# EAGLE design konzole (EAGLE 9.6.2)
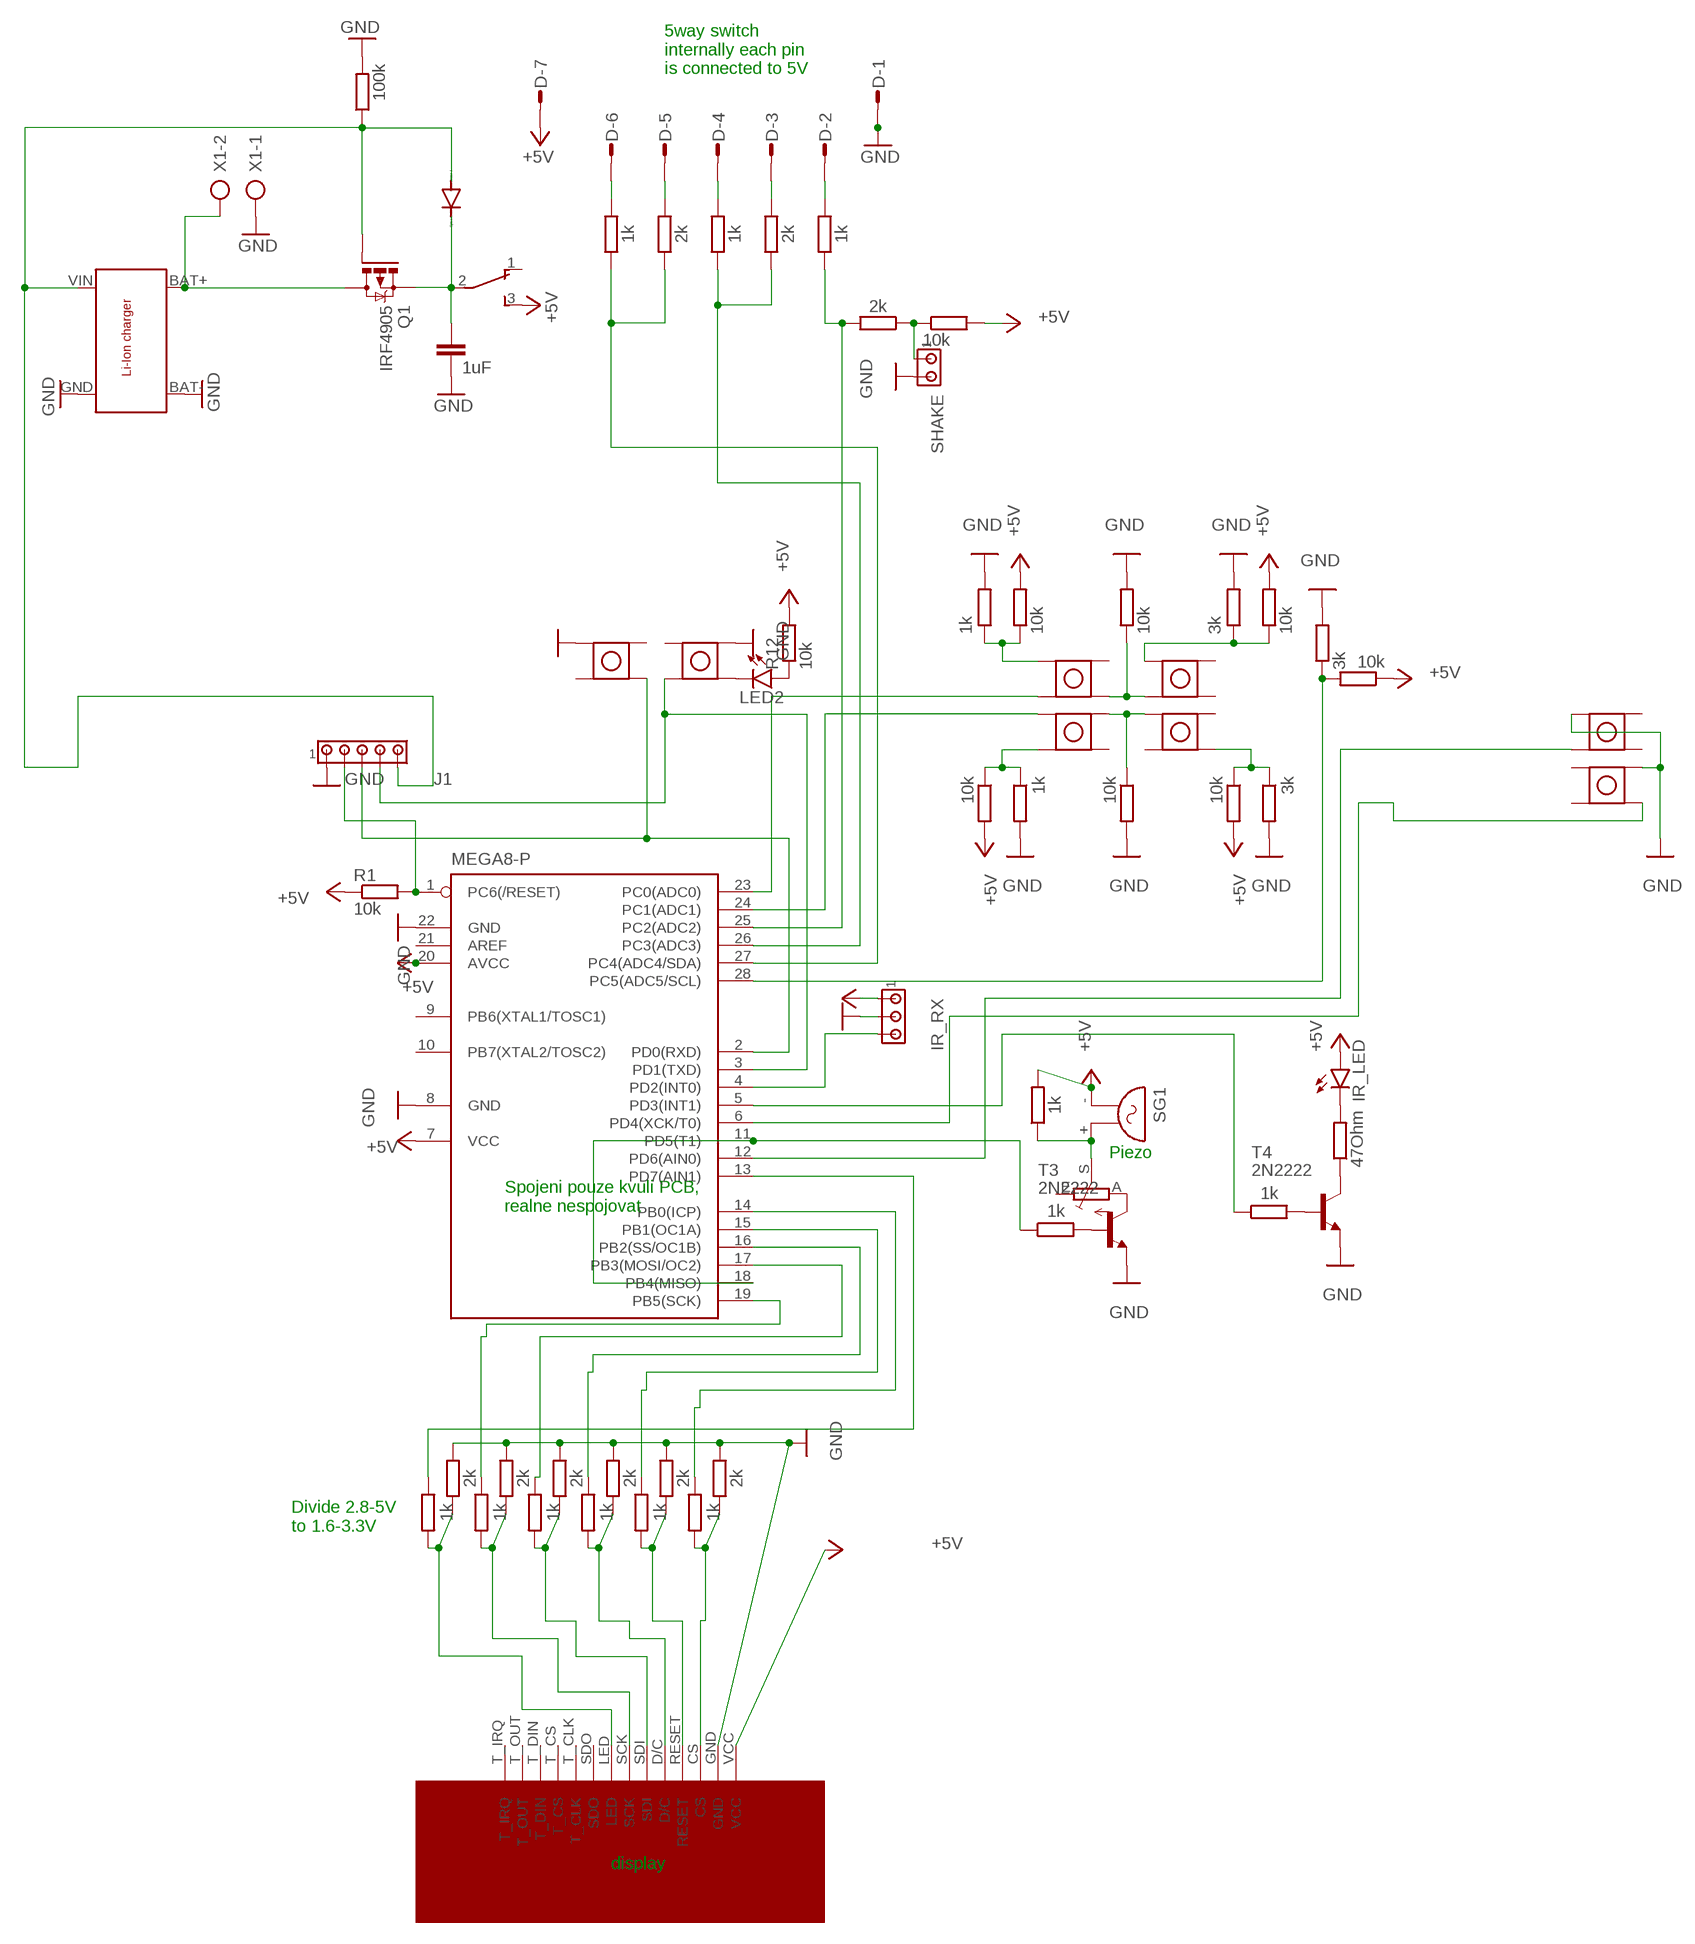
[diagram p0: schematic, sheet 1]

## Parts
C1  1uF  C-EU050-025X075  [C050-025X075]
D  L07P  [L07P]
D1  1N4004  [DO41-10]
IC1  MEGA8-P  [DIL28-3]
IR_LED  LED5MM  [LED5MM]
IR_RX  MTA03-100  [10X03MTA]
J1  MTA05-100  [10X05MTA]
LED2  LED3MM  [LED3MM]
Q1  IRF4905  [TO220BH]
R1  10k  R-EU_0207/10  [0207/10]
R2  1k  R-EU_0207/10  [0207/10]
R3  2k  R-EU_0207/10  [0207/10]
R4  1k  R-EU_0207/10  [0207/10]
R5  2k  R-EU_0207/10  [0207/10]
R6  1k  R-EU_0207/10  [0207/10]
R7  2k  R-EU_0207/10  [0207/10]
R8  1k  R-EU_0207/10  [0207/10]
R9  2k  R-EU_0207/10  [0207/10]
R10  1k  R-EU_0207/10  [0207/10]
R11  2k  R-EU_0207/10  [0207/10]
R12  10k  R-EU_0207/10  [0207/10]
R13  3k  R-EU_0207/10  [0207/10]
R14  10k  R-EU_0207/10  [0207/10]
R15  1k  R-EU_0207/10  [0207/10]
R16  10k  R-EU_0207/10  [0207/10]
R17  3k  R-EU_0207/10  [0207/10]
R18  10k  R-EU_0207/10  [0207/10]
R19  1k  R-EU_0207/10  [0207/10]
R20  10k  R-EU_0207/10  [0207/10]
R21  3k  R-EU_0207/10  [0207/10]
R22  10k  R-EU_0207/10  [0207/10]
R23  10k  R-EU_0207/10  [0207/10]
R24  1k  R-EU_0207/10  [0207/10]
R25  2k  R-EU_0207/10  [0207/10]
R26  1k  R-EU_0207/10  [0207/10]
R27  1k  R-EU_0207/10  [0207/10]
R28  TRIM_EU-CIP20C-6MM  [CIP20C-6MM]
R29  10k  R-EU_0207/10  [0207/10]
R33  1k  R-EU_0207/10  [0207/10]
R34  47Ohm  R-EU_0207/10  [0207/10]
R35  1k  R-EU_0207/10  [0207/10]
R36  2k  R-EU_0207/10  [0207/10]
R38  1k  R-EU_0207/10  [0207/10]
R39  2k  R-EU_0207/10  [0207/10]
R40  1k  R-EU_0207/10  [0207/10]
R41  2k  R-EU_0207/10  [0207/10]
R42  100k  R-EU_0207/10  [0207/10]
R49  10k  R-EU_0207/10  [0207/10]
S1  TL36PO  [TL3XPO]
SG1  F/QMX  [F/QMX]
SHAKE  MTA02-100  [10X02MTA]
T3  2N2222  [TO92-EBC-OVAL]
T4  2N2222  [TO92-EBC-OVAL]
U$1  TACT  [TACT]
U$2  DISPLAY  [DISPLAY]
U$3  TACT  [TACT]
U$4  TACT  [TACT]
U$5  TACT  [TACT]
U$6  TACT  [TACT]
U$7  TACT  [TACT]
U$8  TACT  [TACT]
U$9  TACT  [TACT]
U$10  LI_ION_CHARGER  [LI_ION_CHARGER]
X1  AK500/2  [AK500/2]

## Nets
+5V: D.7 IC1.7(VCC) IC1.20(AVCC) IR_LED.A IR_RX.1 R1.1 R12.2 R14.2 R16.2 R18.2 R20.2 R27.2 R29.1 R49.2 S1.3(S) SG1.- U$2.VCC
GND: C1.2 D.1 IC1.8(GND) IC1.22(GND) IR_RX.2 J1.1 R3.2 R5.2 R7.2 R9.2 R11.2 R13.2 R15.2 R17.2 R19.2 R21.2 R22.2 R23.2 R25.2 R42.2 SHAKE.2 T3.E T4.E U$2.GND U$6.P$4 U$7.P$1 U$8.P$1 U$9.P$4 U$10.BAT- U$10.GND X1.1
N$1: IC1.1(PC6(/RESET)) J1.2 R1.2
N$2: R2.2 R3.1 U$2.CS
N$3: R4.2 R5.1 U$2.RESET
N$4: R6.2 R7.1 U$2.D/C
N$5: R8.2 R9.1 U$2.SDI
N$6: R10.2 R11.1 U$2.SCK
N$7: IC1.17(PB3(MOSI/OC2)) R8.1
N$8: IC1.13(PD7(AIN1)) R24.1
N$9: IC1.16(PB2(SS/OC1B)) R6.1
N$10: IC1.15(PB1(OC1A)) R4.1
N$11: R14.1 R15.1 U$1.P$1
N$12: R27.1 R28.S SG1.+
N$13: IC1.19(PB5(SCK)) R10.1
N$14: R16.1 R17.1 U$5.P$1
N$15: R18.1 R19.1 U$3.P$2
N$16: R20.1 R21.1 U$4.P$3
N$17: R33.2 T4.B
N$18: LED2.K(C) U$9.P$3
N$19: IC1.2(PD0(RXD)) J1.3 U$8.P$3
N$20: IC1.3(PD1(TXD)) J1.4 U$9.P$2
N$21: R23.1 U$3.P$4 U$4.P$1
N$22: R22.1 U$1.P$3 U$5.P$2
N$23: IC1.23(PC0(ADC0)) U$1.P$2
N$24: R24.2 R25.1 U$2.LED
N$25: IC1.24(PC1(ADC1)) U$3.P$1
N$26: R34.1 T4.C
N$27: IC1.11(PD5(T1)) IC1.18(PB4(MISO)) R26.1
N$28: R26.2 T3.B
N$29: R28.A T3.C
N$30: IC1.14(PB0(ICP)) R2.1
N$32: IC1.12(PD6(AIN0)) U$7.P$2
N$33: IC1.28(PC5(ADC5/SCL)) R13.1 R29.2
N$34: IC1.6(PD4(XCK/T0)) U$6.P$3
N$35: LED2.A R12.1
N$36: IC1.4(PD2(INT0)) IR_RX.3
N$39: IR_LED.K(C) R34.2
N$40: IC1.5(PD3(INT1)) R33.1
N$41: D.6 R38.2
N$42: D.5 R36.2
N$43: D.4 R35.2
N$44: Q1.D U$10.BAT+ X1.2
N$45: D.3 R39.2
N$46: D.2 R40.2
N$48: IC1.26(PC3(ADC3)) R35.1 R39.1
N$49: R41.1 R49.1 SHAKE.1
N$50: D1.A J1.5 Q1.G R42.1 U$10.VIN
N$51: C1.1 D1.C Q1.S S1.2(P)
N$52: IC1.25(PC2(ADC2)) R40.1 R41.2
N$54: IC1.27(PC4(ADC4/SDA)) R36.1 R38.1
Unconnected: IC1.9(PB6(XTAL1/TOSC1)) IC1.10(PB7(XTAL2/TOSC2)) IC1.21(AREF) R28.E S1.1(O) U$1.P$4 U$2.SDO U$2.T_CLK U$2.T_CS U$2.T_DIN U$2.T_IRQ U$2.T_OUT U$3.P$3 U$4.P$2 U$4.P$4 U$5.P$3 U$5.P$4 U$6.P$1 U$6.P$2 U$7.P$3 U$7.P$4 U$8.P$2 U$8.P$4 U$9.P$1

## Notes on the sheet
- 5way switch
  internally each pin
  is connected to 5V
- Piezo
- Spojeni pouze kvuli PCB, 
  realne nespojovat
- Divide 2.8-5V
  to 1.6-3.3V
- display

## Library data of the parts
C1 = rcl:C-EU: CAPACITOR, European symbol; SPICEPREFIX: C
D = con-amp-mt:L07P: AMP MT CONNECTOR; OC_FARNELL: unknown; OC_NEWARK: unknown
D1 = diode:1N4004: DIODE general purpose rectifier, 1 A
IC1 = atmel:MEGA8-P: MICROCONTROLLER 8 Kbytes FLASH, 1 kbytes SRAM, 512 bytes EEPROM, USART, 4-channel 10 bit ADC, 2-channel 8 bit ADC Pin compatible with Atmega48, ATMega88, ATMega168 Source: avr.lbr; OC_FARNELL: unknown; OC_NEWARK: unknown
IR_LED LED2 = led:LED: LED OSRAM: - CHIPLED LG R971, LG N971, LY N971, LG Q971, LY Q971, LO R971, LY R971 LH N974, LH R974 LS Q976, LO Q976, LY Q976 LO Q996 - Hyper CHIPLED LW Q18S LB Q993, LB Q99A, LB R99A - SideLED LS A670, LO A670, LY A670, LG A670, LP A670 LB A673, LV A673, LT A673, LW A673 LH A674 LY A675 LS A676, LA A676, LO A676, LY A676, LW A676 LS A679, LY A679, LG A679 - Hyper Micro SIDELED® LS Y876, LA Y876, LO Y876, LY Y876 LT Y87S - SmartLED LW L88C, LW L88S LB L89C, LB L89S, LG L890 LS L89K, LO L89K, LY L89K LS L896, LA L896, LO L896, LY L896 - TOPLED LS T670, LO T670, LY T670, LG T670, LP T670 LSG T670, LSP T670, LSY T670, LOP T670, LYG T670 LG T671, LOG T671, LSG T671 LB T673, LV T673, LT T673, LW T673 LH T674 LS T676, LA T676, LO T676, LY T676, LB T676, LH T676, LSB T676, LW T676 LB T67C, LV T67C, LT T67C, LS T67K, LO T67K, LY T67K, LW E67C LS E67B, LA E67B, LO E67B, LY E67B, LB E67C, LV E67C, LT E67C LW T67C LS T679, LY T679, LG T679 LS T770, LO T770, LY T770, LG T770, LP T770 LB T773, LV T773, LT T773, LW T773 LH T774 LS E675, LA E675, LY E675, LS T675 LS T776, LA T776, LO T776, LY T776, LB T776 LHGB T686 LT T68C, LB T68C - Hyper Mini TOPLED® LB M676 - Mini TOPLED Santana® LG M470 LS M47K, LO M47K, LY M47K Source: http://www.osram.convergy.de LUXEON: - LUMILED® LXK2-PW12-R00, LXK2-PW12-S00, LXK2-PW14-U00, LXK2-PW14-V00 LXK2-PM12-R00, LXK2-PM12-S00, LXK2-PM14-U00 LXK2-PE12-Q00, LXK2-PE12-R00, LXK2-PE12-S00, LXK2-PE14-T00, LXK2-PE14-U00 LXK2-PB12-K00, LXK2-PB12-L00, LXK2-PB12-M00, LXK2-PB14-N00, LXK2-PB14-P00, LXK2-PB14-Q00 LXK2-PR12-L00, LXK2-PR12-M00, LXK2-PR14-Q00, LXK2-PR14-R00 LXK2-PD12-Q00, LXK2-PD12-R00, LXK2-PD12-S00 LXK2-PH12-R00, LXK2-PH12-S00 LXK2-PL12-P00, LXK2-PL12-Q00, LXK2-PL12-R00 Source: www.luxeon.com KINGBRIGHT: KA-3528ASYC Source: www.kingbright.com
IR_RX = con-amp:MTA03-100: AMP connector
J1 = con-amp:MTA05-100: AMP connector
Q1 = transistor-power:IRF4905: P-Channel HEXFET® Power MOSFET RDS(on)= 0.02 Ohm, ID = -74A Source: http://www.irf.com/product-info/datasheets/data/irf4905pbf.pdf
R1-R27 R29 R33-R36 R38-R42 R49 = rcl:R-EU_: RESISTOR, European symbol; SPICEPREFIX: R
R28 = pot:TRIM_EU-: POTENTIOMETER
S1 = switch:TL36PO: TINY SWITCH ON - ON Source: http://www2.produktinfo.conrad.com/datenblaetter/700000-724999/705152-da-01-de-Subminiaturschalter_TL_36YO.pdf
SG1 = buzzer:F/QMX: BUZZER Source: Buerklin; OC_FARNELL: unknown; OC_NEWARK: unknown
SHAKE = con-amp:MTA02-100: AMP connector
T3 T4 = adafruit:2N2222: NPN TRANSISTOR Big oval pads
U$1 U$3-U$9 = PSicho:TACT
U$2 = PSicho:DISPLAY
U$10 = PSicho:LI_ION_CHARGER
X1 = con-ptr500:AK500/2: CONNECTOR; OC_FARNELL: unknown; OC_NEWARK: unknown

## Board
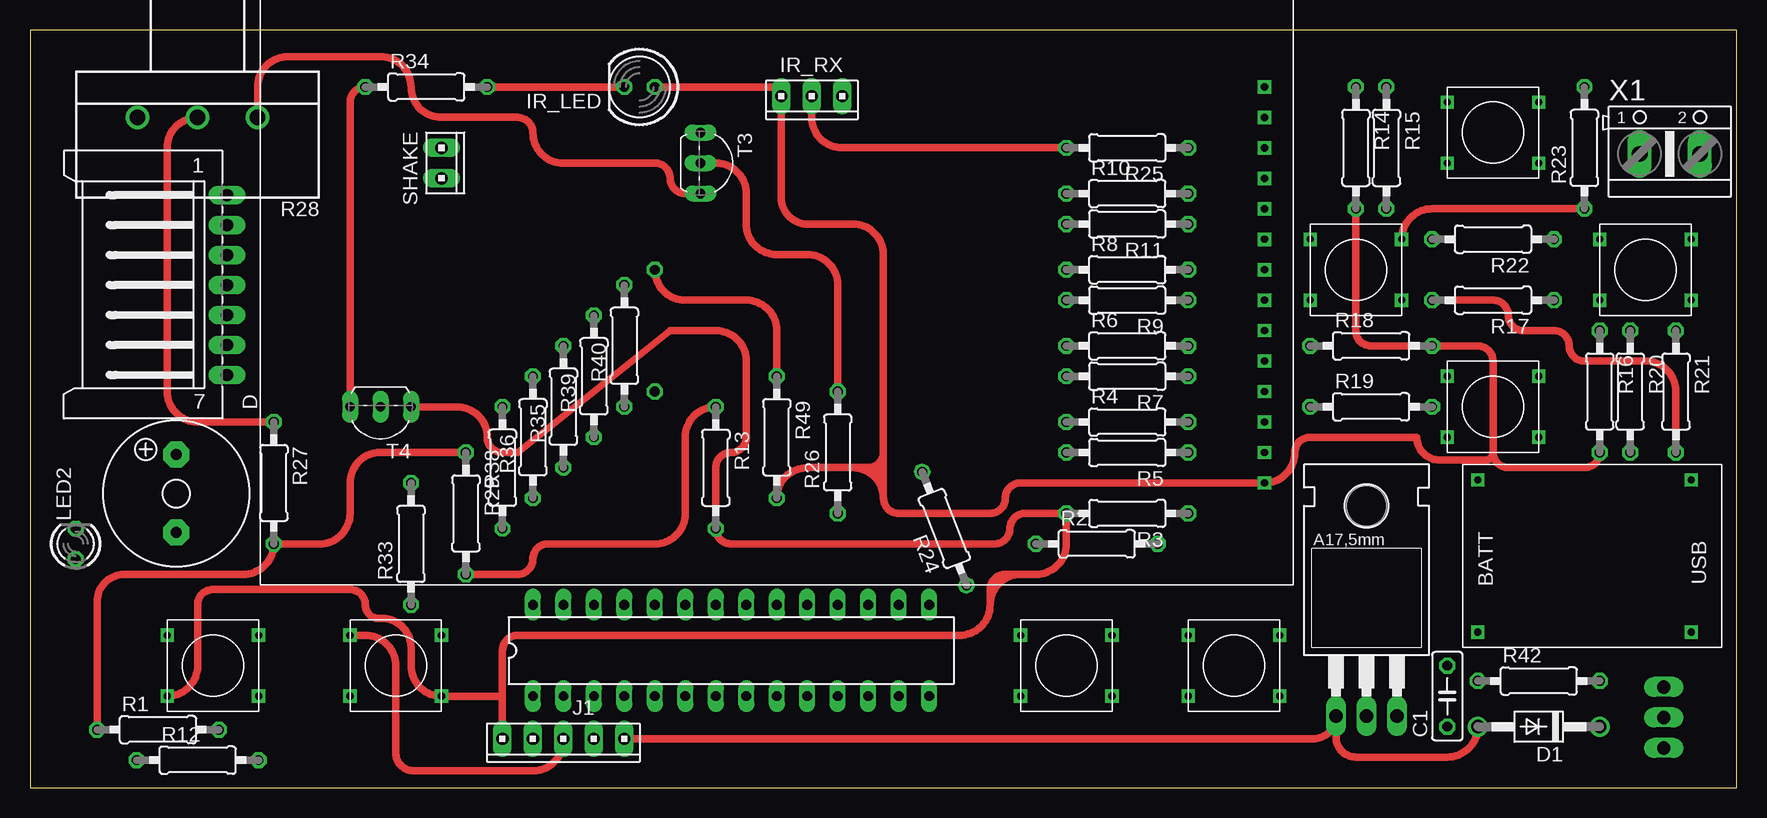
[diagram p1: board, top side]
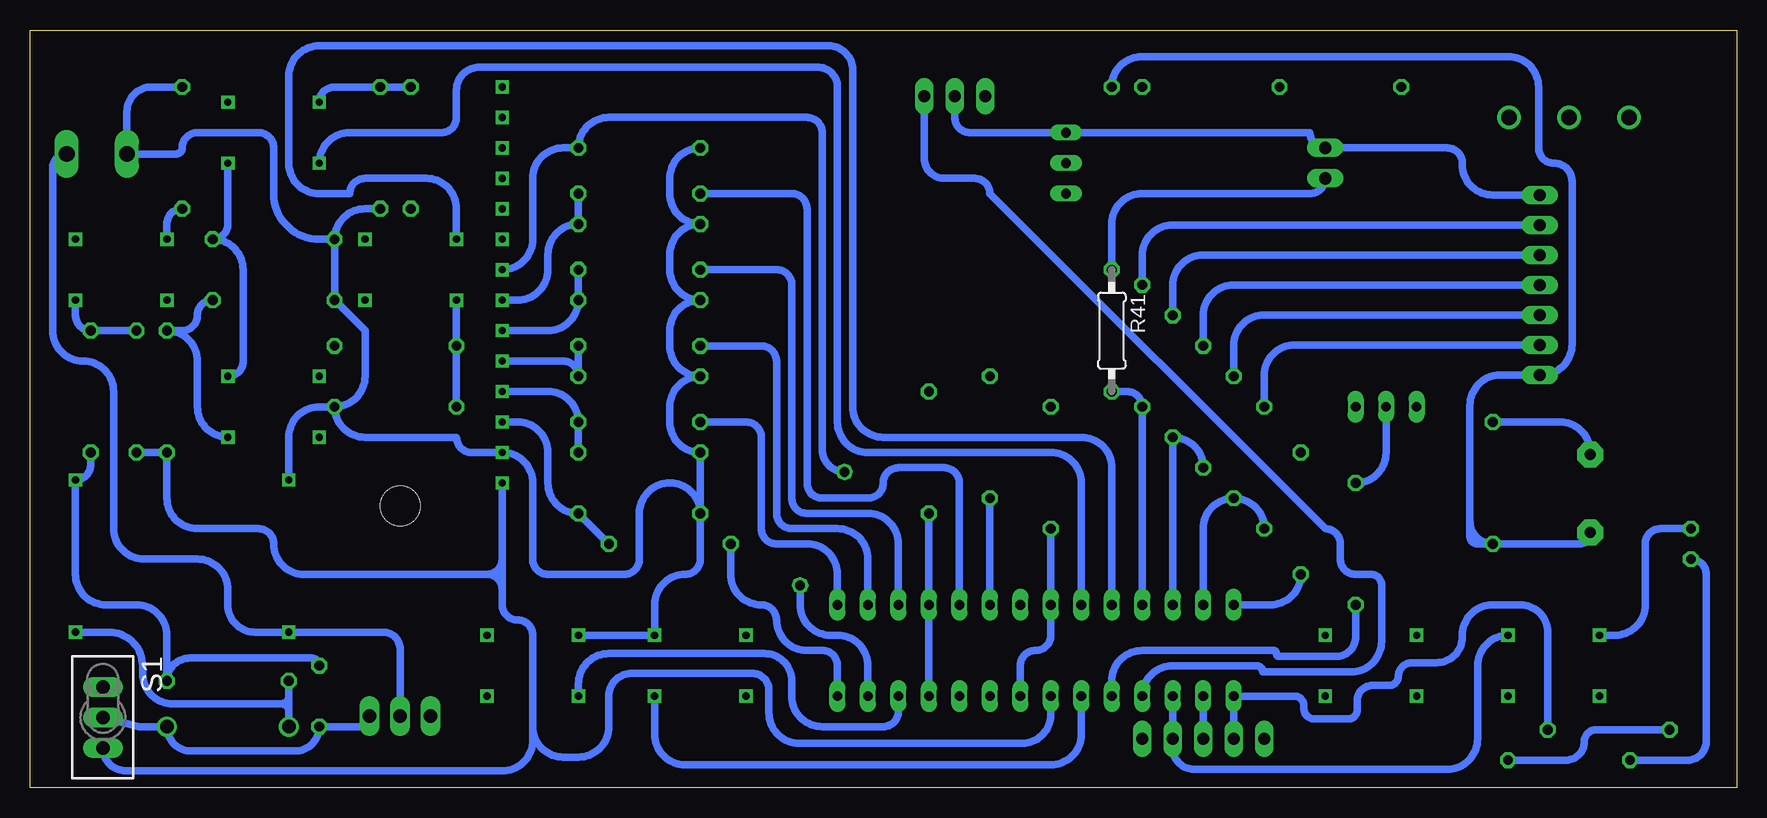
[diagram p2: board, bottom side, seen from below]

Size 142.22 x 63.17 mm. Coordinates in mm from the lower left corner, seen from the top.
Outline: 0,0 142.22,0 142.22,63.17 0,63.17 0,0
Copper layers (1*16): Top 0.035mm / dielectric 1.5mm / Bottom 0.035mm
Design rules "default *": minimum track width 24mil, minimum drill 0.6mm, track to track 24mil, track to pad 24mil, pad to pad 24mil, via to via 24mil, smd to smd 6mil, copper to edge 40mil, drill to drill 6mil, minimum pad ring 10mil, minimum via ring 8mil, stop-mask expansion 4mil, vias tented up to drill 0mil, thermal gap 10mil

### Footprints (pad centres in the part's own frame; a part is rotated, then mirrored left to right if it is on the bottom)
C050-025X075 = drill 0.813 octagon: 1 -2.54,0; 2 2.54,0
L07P = drill 1.016 long: 1 7.5,-6.25; 2 5,-6.25; 3 2.5,-6.25; 4 0,-6.25; 5 -2.5,-6.25; 6 -5,-6.25; 7 -7.5,-6.25
DO41-10 = drill 1.118: A 5.08,0; C -5.08,0
DIL28-3 = drill 0.813 long: 1 -16.51,-3.81; 2 -13.97,-3.81; 3 -11.43,-3.81; 4 -8.89,-3.81; 5 -6.35,-3.81; 6 -3.81,-3.81; 7 -1.27,-3.81; 8 1.27,-3.81; 9 3.81,-3.81; 10 6.35,-3.81; 11 8.89,-3.81; 12 11.43,-3.81; 13 13.97,-3.81; 14 16.51,-3.81; 15 16.51,3.81; 16 13.97,3.81; 17 11.43,3.81; 18 8.89,3.81; 19 6.35,3.81; 20 3.81,3.81; 21 1.27,3.81; 22 -1.27,3.81; 23 -3.81,3.81; 24 -6.35,3.81; 25 -8.89,3.81; 26 -11.43,3.81; 27 -13.97,3.81; 28 -16.51,3.81
LED5MM = drill 0.813 octagon: A -1.27,0; K 1.27,0
10X03MTA = drill 1.016 long: 1 2.54,0; 2 0,0; 3 -2.54,0
10X05MTA = drill 1.016 long: 1 5.08,0; 2 2.54,0; 3 0,0; 4 -2.54,0; 5 -5.08,0
LED3MM = drill 0.813 octagon: A -1.27,0; K 1.27,0
TO220BH = drill 1.118 long: D 0,-6.35; G -2.54,-6.35; S 2.54,-6.35 | hole 3.302: 0,11.176
0207/10 = drill 0.813 octagon: 1 -5.08,0; 2 5.08,0
CIP20C-6MM = drill 1.3 pad 1.93: A -5,0; E 5,0; S 0,0
TL3XPO = drill 1.1 pad 1.422 long: 1 -2.54,0; 2 0,0; 3 2.54,0
F/QMX = drill 0.914 pad 2.159 octagon: + 3.251,0; - -3.251,0
10X02MTA = drill 1.016 long: 1 1.27,0; 2 -1.27,0
TO92-EBC-OVAL = drill 0.813 long: B 0,-1.27; C 2.54,-1.27; E -2.54,-1.27
TACT = drill 0.6 square: P$1 -3.81,2.54; P$2 -3.81,-2.54; P$3 3.81,-2.54; P$4 3.81,2.54
DISPLAY = drill 0.6 square: CS -40.64,11.43; D/C -40.64,6.35; GND -40.64,13.97; LED -40.64,-1.27; RESET -40.64,8.89; SCK -40.64,1.27; SDI -40.64,3.81; SDO -40.64,-3.81; T_CLK -40.64,-6.35; T_CS -40.64,-8.89; T_DIN -40.64,-11.43; T_IRQ -40.64,-16.51; T_OUT -40.64,-13.97; VCC -40.64,16.51
LI_ION_CHARGER = drill 0.6 square: BAT+ 8.89,6.35; BAT- 8.89,-6.35; GND -8.89,-6.35; VIN -8.89,6.35
AK500/2 = drill 1.321 long: 1 -2.515,0; 2 2.515,0

### Placement (x,y rotation side)
C1  118.11,7.62 90 top
D  10.16,41.91 90 top
D1  125.73,5.08 180 top
IC1  58.42,11.43 0 top
IR_LED  50.8,58.42 180 top
IR_RX  65.15,57.66 180 top
J1  44.45,4.06 180 top
LED2  3.81,20.32 90 top
Q1  111.38,12.32 0 top
R1  10.67,4.83 0 top
R2  88.9,20.32 0 top
R3  91.44,22.86 180 top
R4  91.44,30.48 0 top
R5  91.44,27.94 180 top
R6  91.44,36.83 0 top
R7  91.44,34.29 180 top
R8  91.44,43.18 0 top
R9  91.44,40.64 180 top
R10  91.44,49.53 0 top
R11  91.44,46.99 180 top
R12  13.97,2.29 0 top
R13  57.15,26.67 270 top
R14  110.49,53.34 270 top
R15  113.03,53.34 270 top
R16  130.81,33.02 270 top
R17  121.92,40.64 180 top
R18  111.76,36.83 0 top
R19  111.76,31.75 0 top
R20  133.35,33.02 270 top
R21  137.16,33.02 270 top
R22  121.92,45.72 180 top
R23  129.54,53.34 90 top
R24  76.2,21.59 111.3 top
R25  91.44,53.34 180 top
R26  67.31,27.94 90 top
R27  20.32,25.4 270 top
R28  13.97,55.88 180 top
R29  36.32,22.86 270 top
R33  31.75,20.32 90 top
R34  33.02,58.42 0 top
R35  44.45,31.75 90 top
R36  41.91,29.21 90 top
R38  39.37,26.67 90 top
R39  46.99,34.29 90 top
R40  49.53,36.83 90 top
R41  52.07,38.1 270 bottom
R42  125.73,8.89 0 top
R49  62.23,29.21 270 top
S1  136.14,5.84 270 bottom
SG1  12.19,24.51 90 top
SHAKE  34.29,52.07 270 top
T3  57.15,52.07 270 top
T4  29.21,30.48 180 top
U$1  121.92,54.61 0 top
U$2  62.23,41.91 180 top
U$3  110.49,43.18 0 top
U$4  134.62,43.18 0 top
U$5  121.92,31.75 180 top
U$6  86.36,10.16 0 top
U$7  100.33,10.16 0 top
U$8  30.48,10.16 180 top
U$9  15.24,10.16 180 top
U$10  129.54,19.3 180 top
X1  136.65,52.83 0 top

### Tracks (layer width: path | path; a pad name or v marks a point on that pad's centre or on a via)
+5V
  Top 0.61: 121.92,27.94 121.92,35.56 arc90 120.65,36.83 R18.2 111.76,36.83 arc-90 110.49,38.1 R14.2 | 71.12,24.13 arc90 72.39,22.86 80.01,22.86 arc90 81.28,24.13 arc-90 82.55,25.4 U$2.VCC arc90 105.41,27.94 arc-90 106.68,29.21 115.57,29.21 arc90 117.47,27.3 121.28,27.3 arc90 121.92,27.94 | 71.12,24.13 arc90 68.58,26.67 | 68.58,26.67 64.77,26.67 arc90 R49.2 | 71.12,27.94 71.12,44.45 arc90 68.58,46.99 64.77,46.99 arc-90 62.61,49.15 IR_RX.1 arc90 61.85,58.42 IR_LED.A | 71.12,27.94 71.12,26.67 | 71.12,26.67 71.12,25.4 | 71.12,25.4 71.12,24.13 | 68.58,26.67 69.85,26.67 | 69.85,26.67 arc90 71.12,27.94 | 69.85,26.67 arc-90 71.12,25.4 | 69.85,26.67 arc90 71.12,27.94 | 69.85,26.67 71.12,26.67 | R16.2 arc-90 129.54,26.67 123.19,26.67 arc-90 121.92,27.94 | R1.1 5.59,15.49 arc-90 7.87,17.78 17.78,17.78 arc90 R27.2 24.13,20.32 arc90 26.67,22.86 26.67,25.4 arc-90 29.21,27.94 R29.1
  Bottom 0.61: 100.33,5.08 100.33,12.7 arc-90 101.6,13.97 arc90 102.87,15.24 102.87,16.51 | 102.87,16.51 102.87,17.78 | 102.87,17.78 102.87,19.05 | 102.87,19.05 U$2.VCC | IC1.7 57.15,6.1 arc90 59.56,3.68 78.1,3.68 arc90 80.65,6.22 80.65,6.35 80.65,8.13 arc-90 82.04,9.52 92.07,9.52 arc-90 93.98,7.62 93.98,5.08 arc90 96.52,2.54 97.79,2.54 arc90 100.33,5.08 | R20.2 R16.2 130.81,24.13 arc-90 128.27,21.59 123.19,21.59 arc90 121.92,20.32 arc-90 119.38,17.78 104.14,17.78 | R27.2 13.13,20.32 arc-90 SG1.- | R27.2 21.59,20.32 arc90 22.23,20.95 22.23,22.23 | 22.23,22.23 arc-90 R27.2 | 22.23,22.23 22.23,30.48 22.23,31.87 arc90 19.69,34.41 D.7 16.26,34.41 arc-90 13.72,36.95 13.72,50.55 arc-90 15.24,52.07 arc90 16.51,53.34 16.51,58.42 arc-90 19.05,60.96 49.53,60.96 arc-90 IR_LED.A | S1.3 arc-90 134.24,1.4 102.87,1.4 arc-90 100.33,3.94 100.33,5.08 | R12.2 14.22,2.29 arc-90 12.7,3.81 arc90 11.68,4.83 R1.1 | R49.2 IC1.20 | 102.87,17.78 104.14,17.78 | 104.14,17.78 arc-90 102.87,19.05 | 104.14,17.78 arc90 102.87,16.51
GND
  Top 0.61: R21.2 137.16,33.02 arc90 134.62,35.56 129.54,35.56 arc-90 128.27,36.83 arc90 127,38.1 124.46,38.1 arc-90 123.19,39.37 arc90 121.92,40.64 R17.2 | 82.55,17.78 81.28,17.78 arc90 80.01,16.51 80.01,15.24 | 82.55,17.78 arc90 80.01,15.24 | 80.01,15.24 arc-90 77.47,12.7 40.64,12.7 arc90 39.37,11.43 39.37,7.62 | 39.37,7.62 J1.1 | R25.2 67.69,53.34 arc-90 65.15,55.88 IR_RX.2 | 82.55,17.78 83.82,17.78 arc90 86.36,20.32 R3.2 82.93,22.86 arc90 81.66,21.59 arc-90 80.39,20.32 58.42,20.32 arc-90 R13.2 57.15,26.67 arc-90 58.42,27.94 arc90 59.69,29.21 59.69,35.56 arc90 57.15,38.1 53.34,38.1 40.64,27.94 39.37,27.94 arc-90 38.1,29.21 arc90 35.56,31.75 T4.E | 39.37,7.62 U$8.P$1 arc-90 31.75,10.16 31.75,11.68 arc90 29.34,14.1 29.08,14.1 arc-90 27.94,15.24 arc90 26.67,16.51 15.24,16.51 arc90 13.97,15.24 13.97,10.16 arc-90 U$9.P$4
  Bottom 0.61: R3.2 arc-90 88.9,25.4 arc-90 91.44,22.86 91.44,19.05 arc90 92.71,17.78 99.06,17.78 arc90 100.33,19.05 100.33,25.4 arc-90 U$2.GND 105.41,27.94 arc90 106.68,29.21 114.3,29.21 arc90 R19.2 | R3.2 R5.2 arc90 88.9,30.48 88.9,31.75 arc90 R7.2 arc90 88.9,36.83 88.9,38.1 arc90 R9.2 arc90 88.9,43.18 88.9,44.45 arc90 R11.2 arc90 88.9,49.53 88.9,50.8 arc90 R25.2 | R23.2 132.08,58.42 arc-90 134.14,56.36 X1.1 130.05,52.83 arc-90 129.54,53.34 arc90 128.27,54.61 123.19,54.61 arc90 121.92,53.34 121.92,49.53 arc-90 118.11,45.72 R22.2 | R22.2 R17.2 114.3,38.1 114.3,34.29 arc90 R19.2 | R22.2 arc90 114.3,48.26 R15.2 | U$7.P$1 U$6.P$4 90.17,15.24 arc90 87.63,17.78 arc-90 86.36,19.05 R3.2 | IC1.8 59.69,10.16 arc90 58.42,11.43 arc-90 57.15,12.7 IC1.22 57.15,19.05 R13.2 | IR_RX.2 65.15,55.88 arc-90 63.88,54.61 T3.E 35.56,54.61 arc-90 SHAKE.2 24.13,53.34 arc90 22.86,52.07 22.86,51.95 arc-90 20.32,49.41 D.1 | R21.2 137.16,26.92 arc90 U$10.GND 138.43,17.78 arc-90 135.89,15.24 133.35,15.24 arc90 130.81,12.7 R42.2 arc90 128.91,10.8 118.75,10.8 arc90 C1.2 | R19.2 118.11,31.75 arc-90 120.65,29.21 U$10.BAT-
N$1
  Bottom 0.61: J1.2 IC1.1 36.83,7.62 arc90 36.07,6.86 36.07,6.6 arc-90 35.18,5.71 32.38,5.71 arc-90 31.62,6.48 31.62,7.24 arc90 30.35,8.51 28.96,8.51 arc-90 28.19,9.27 arc90 27.05,10.41 25.02,10.41 arc-90 22.86,12.57 22.86,12.7 arc90 20.32,15.24 18.03,15.24 arc90 15.75,12.95 R1.2
N$2
  Bottom 0.61: R2.2 R3.1 arc90 99.06,25.4 99.06,27.94 arc-90 101.6,30.48 U$2.CS
N$3
  Bottom 0.61: R5.1 R4.2 arc-90 99.06,33.02 U$2.RESET
N$4
  Bottom 0.61: R6.2 R7.1 arc-90 97.79,35.56 U$2.D/C
N$5
  Bottom 0.61: R8.2 R9.1 arc90 99.06,38.1 U$2.SDI
N$6
  Bottom 0.61: U$2.SCK 101.6,40.64 arc-90 99.06,43.18 99.06,44.45 arc90 R11.1 R10.2
N$7
  Bottom 0.61: IC1.17 69.85,20.32 arc-90 72.39,22.86 77.47,22.86 arc90 78.74,24.13 78.74,41.91 arc-90 80.01,43.18 R8.1
N$8
  Bottom 0.61: R24.1 78.04,15.24 arc-90 75.5,12.7 74.93,12.7 arc90 72.39,10.16 IC1.13
N$9
  Bottom 0.61: IC1.16 72.39,19.05 arc-90 74.93,21.59 78.74,21.59 arc90 80.01,22.86 80.01,35.56 arc-90 81.28,36.83 R6.1
N$10
  Bottom 0.61: IC1.15 74.93,17.78 arc-90 77.47,20.32 80.01,20.32 arc90 81.28,21.59 81.28,29.21 arc-90 82.55,30.48 R4.1
N$11
  Bottom 0.61: R14.1 R15.1 116.84,58.42 arc-90 U$1.P$1
N$12
  Top 0.61: R27.1 13.97,30.48 arc-90 11.43,33.02 11.43,53.34 arc-90 R28.S
  Bottom 0.61: R27.1 14.73,30.48 arc90 12.19,27.94 SG1.+
N$13
  Bottom 0.61: R10.1 78.74,49.53 arc90 77.47,48.26 77.47,25.4 arc-90 76.2,24.13 72.39,24.13 arc-90 71.12,25.4 arc90 69.85,26.67 66.04,26.67 arc90 64.77,25.4 IC1.19
N$14
  Bottom 0.61: U$5.P$1 arc90 128.27,31.75 128.27,35.56 arc-90 R16.1 129.54,38.1 arc-90 128.27,39.37 arc90 R17.1
N$15
  Bottom 0.61: U$3.P$2 R18.1 R19.1
N$16
  Bottom 0.61: R20.1 R21.1 arc90 138.43,39.37 U$4.P$3
N$17
  Bottom 0.61: R33.2 arc-90 29.21,27.94 T4.B
N$18
  Bottom 0.61: U$9.P$3 10.16,12.7 arc-90 7.62,15.24 7.62,20.32 arc90 6.35,21.59 LED2.K
N$19
  Top 0.61: U$8.P$3 27.94,12.7 arc-90 30.48,10.16 30.48,2.92 arc90 32,1.4 41.91,1.4 arc90 44.45,3.94 J1.3
  Bottom 0.61: IC1.2 J1.3
N$20
  Bottom 0.61: IC1.3 J1.4 46.99,3.3 arc-90 45.21,1.52 24.13,1.52 arc-90 21.59,4.06 21.59,10.16 arc90 U$9.P$2
N$21
  Top 0.61: R23.1 116.84,48.26 arc90 U$3.P$4
  Bottom 0.61: U$4.P$1 130.81,46.99 arc90 R23.1
N$22
  Bottom 0.61: U$5.P$2 arc-90 124.46,35.56 124.46,43.18 arc-90 R22.1 arc-90 125.73,46.99 U$1.P$3
N$23
  Bottom 0.61: U$1.P$2 arc90 115.57,54.61 107.95,54.61 arc-90 106.68,55.88 106.68,58.17 arc90 104.78,60.07 76.58,60.07 arc90 74.93,58.42 74.93,30.48 arc-90 72.39,27.94 57.15,27.94 arc90 54.61,25.4 IC1.23
N$24
  Bottom 0.61: U$2.LED arc-90 100.33,45.72 100.33,50.8 arc90 97.79,53.34 R25.1 arc90 93.98,55.88 77.47,55.88 arc90 76.2,54.61 76.2,28.17 arc-90 R24.2
N$25
  Bottom 0.61: IC1.24 52.07,26.67 arc-90 54.61,29.21 71.12,29.21 arc90 73.66,31.75 73.66,59.82 arc-90 75.69,61.85 118.11,61.85 arc-90 120.65,59.31 120.65,52.07 arc-90 118.11,49.53 115.57,49.53 arc90 114.3,50.8 109.22,50.8 arc90 106.68,48.26 U$3.P$1
N$26
  Top 0.61: T4.C 26.67,57.15 arc-90 R34.1
N$27
  Bottom 0.61: R26.1 IC1.18 IC1.11
N$28
  Top 0.61: R26.2 67.31,41.91 arc90 64.77,44.45 62.23,44.45 arc-90 59.69,46.99 59.69,49.53 arc90 57.15,52.07 T3.B
N$29
  Top 0.61: T3.C 54.61,49.53 arc-90 53.34,50.8 arc90 52.07,52.07 44.45,52.07 arc-90 41.91,54.61 arc90 40.64,55.88 34.29,55.88 arc-90 31.75,58.42 arc90 29.21,60.96 21.51,60.96 arc90 18.97,58.42 R28.A
N$30
  Bottom 0.61: R2.1 83.82,17.78 arc-90 81.28,15.24 arc90 80.01,13.97 arc-90 77.47,11.43 76.2,11.43 arc90 74.93,10.16 IC1.14
N$32
  Bottom 0.61: U$7.P$2 96.52,8.64 arc90 93.98,11.18 81.03,11.18 arc90 78.74,8.89 78.74,7.62 arc-90 76.2,5.08 71.12,5.08 arc-90 69.85,6.35 IC1.12
N$33
  Top 0.61: R13.1 arc90 54.61,29.21 54.61,22.86 arc-90 52.07,20.32 43.18,20.32 arc90 41.91,19.05 arc-90 40.64,17.78 R29.2
  Bottom 0.61: IC1.28 38.86,15.24 arc-90 R29.2
N$34
  Bottom 0.61: IC1.6 54.61,4.45 arc90 57.15,1.9 87.63,1.9 arc90 90.17,4.45 U$6.P$3
N$35
  Bottom 0.61: LED2.A arc90 2.54,17.78 2.54,3.81 arc90 4.06,2.29 R12.1
N$36
  Bottom 0.61: IC1.4 arc90 46.99,10.16 40.01,10.16 arc90 39.5,9.65 32.13,9.65 arc-90 29.59,12.19 29.59,16.89 arc-90 30.48,17.78 31.75,17.78 arc90 33.02,19.05 33.02,20.32 arc-90 34.29,21.59 62.23,49.53 arc-90 63.5,50.8 66.04,50.8 arc90 67.69,52.45 IR_RX.3
N$39
  Top 0.61: IR_LED.K R34.2
N$40
  Bottom 0.61: IC1.5 52.07,8.89 arc90 49.53,11.43 38.61,11.43 arc90 38.35,11.18 arc-90 38.1,10.92 33.4,10.92 arc-90 31.75,12.57 R33.1
N$41
  Bottom 0.61: R38.2 39.37,34.37 arc90 36.83,36.91 D.6
N$42
  Bottom 0.61: R36.2 41.91,36.87 arc90 39.37,39.41 D.5
N$43
  Bottom 0.61: R35.2 44.45,39.37 arc90 41.91,41.91 D.4
N$44
  Bottom 0.61: Q1.D 111.38,11.56 arc-90 112.78,12.95 U$10.BAT+ 123.44,12.95 arc90 125.73,15.24 125.73,16.51 arc-90 128.27,19.05 132.72,19.05 arc90 135.25,21.59 135.25,33.02 arc-90 137.79,35.56 arc90 140.34,38.1 140.34,51.66 arc90 X1.2
N$45
  Bottom 0.61: R39.2 46.99,41.87 arc90 44.45,44.41 D.3
N$46
  Bottom 0.61: R40.2 49.53,44.37 arc90 46.99,46.91 D.2
N$48
  Bottom 0.61: IC1.26 R39.1 arc90 R35.1
N$49
  Top 0.61: R49.1 62.23,38.1 arc90 59.69,40.64 54.61,40.64 arc-90 R41.1
  Bottom 0.61: R41.1 52.07,46.99 arc90 49.53,49.53 35.56,49.53 arc-90 SHAKE.1
N$50
  Top 0.61: D1.A arc-90 118.11,2.54 110.49,2.54 arc-90 108.84,4.19 Q1.G arc-90 106.93,4.06 J1.5
  Bottom 0.61: R42.1 120.65,7.62 | 120.65,7.62 120.65,6.35 | 120.65,6.35 D1.A | U$10.VIN 135.64,12.95 arc90 132.84,10.16 132.84,9.52 arc-90 130.3,6.98 121.28,6.98 | 120.65,6.35 arc-90 121.28,6.98 | 121.28,6.98 arc-90 120.65,7.62
N$51
  Bottom 0.61: Q1.S arc90 114.81,5.08 C1.1 arc90 120.14,3.05 128.78,3.05 arc90 D1.C 133.1,5.08 S1.2
N$52
  Bottom 0.61: IC1.25 R40.1 arc-90 50.8,33.02 R41.2
N$54
  Bottom 0.61: IC1.27 44.45,21.59 arc90 R36.1 arc90 R38.1